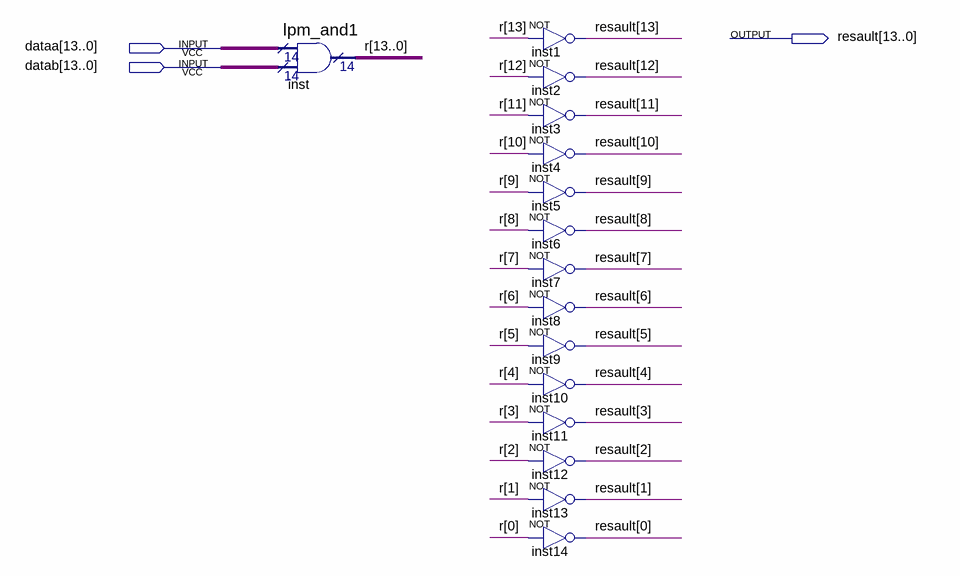
[diagram p0: schematic sheet]
// Quartus schematic ALD_NAND.bdf as structural Verilog: 15 symbols, 3 pins
module ALD_NAND (
  input  [13:0] dataa,
  input  [13:0] datab,
  output [13:0] resault
);

  wire [13:0] r;

  lpm_and1 inst (.data0x(dataa), .data1x(datab), .result(r));
  not inst1 (resault[13], r[13]);
  not inst2 (resault[12], r[12]);
  not inst3 (resault[11], r[11]);
  not inst4 (resault[10], r[10]);
  not inst5 (resault[9], r[9]);
  not inst6 (resault[8], r[8]);
  not inst7 (resault[7], r[7]);
  not inst8 (resault[6], r[6]);
  not inst9 (resault[5], r[5]);
  not inst10 (resault[4], r[4]);
  not inst11 (resault[3], r[3]);
  not inst12 (resault[2], r[2]);
  not inst13 (resault[1], r[1]);
  not inst14 (resault[0], r[0]);
endmodule
